# EAGLE design placa-circuito-impresso (EAGLE 9.6.0)
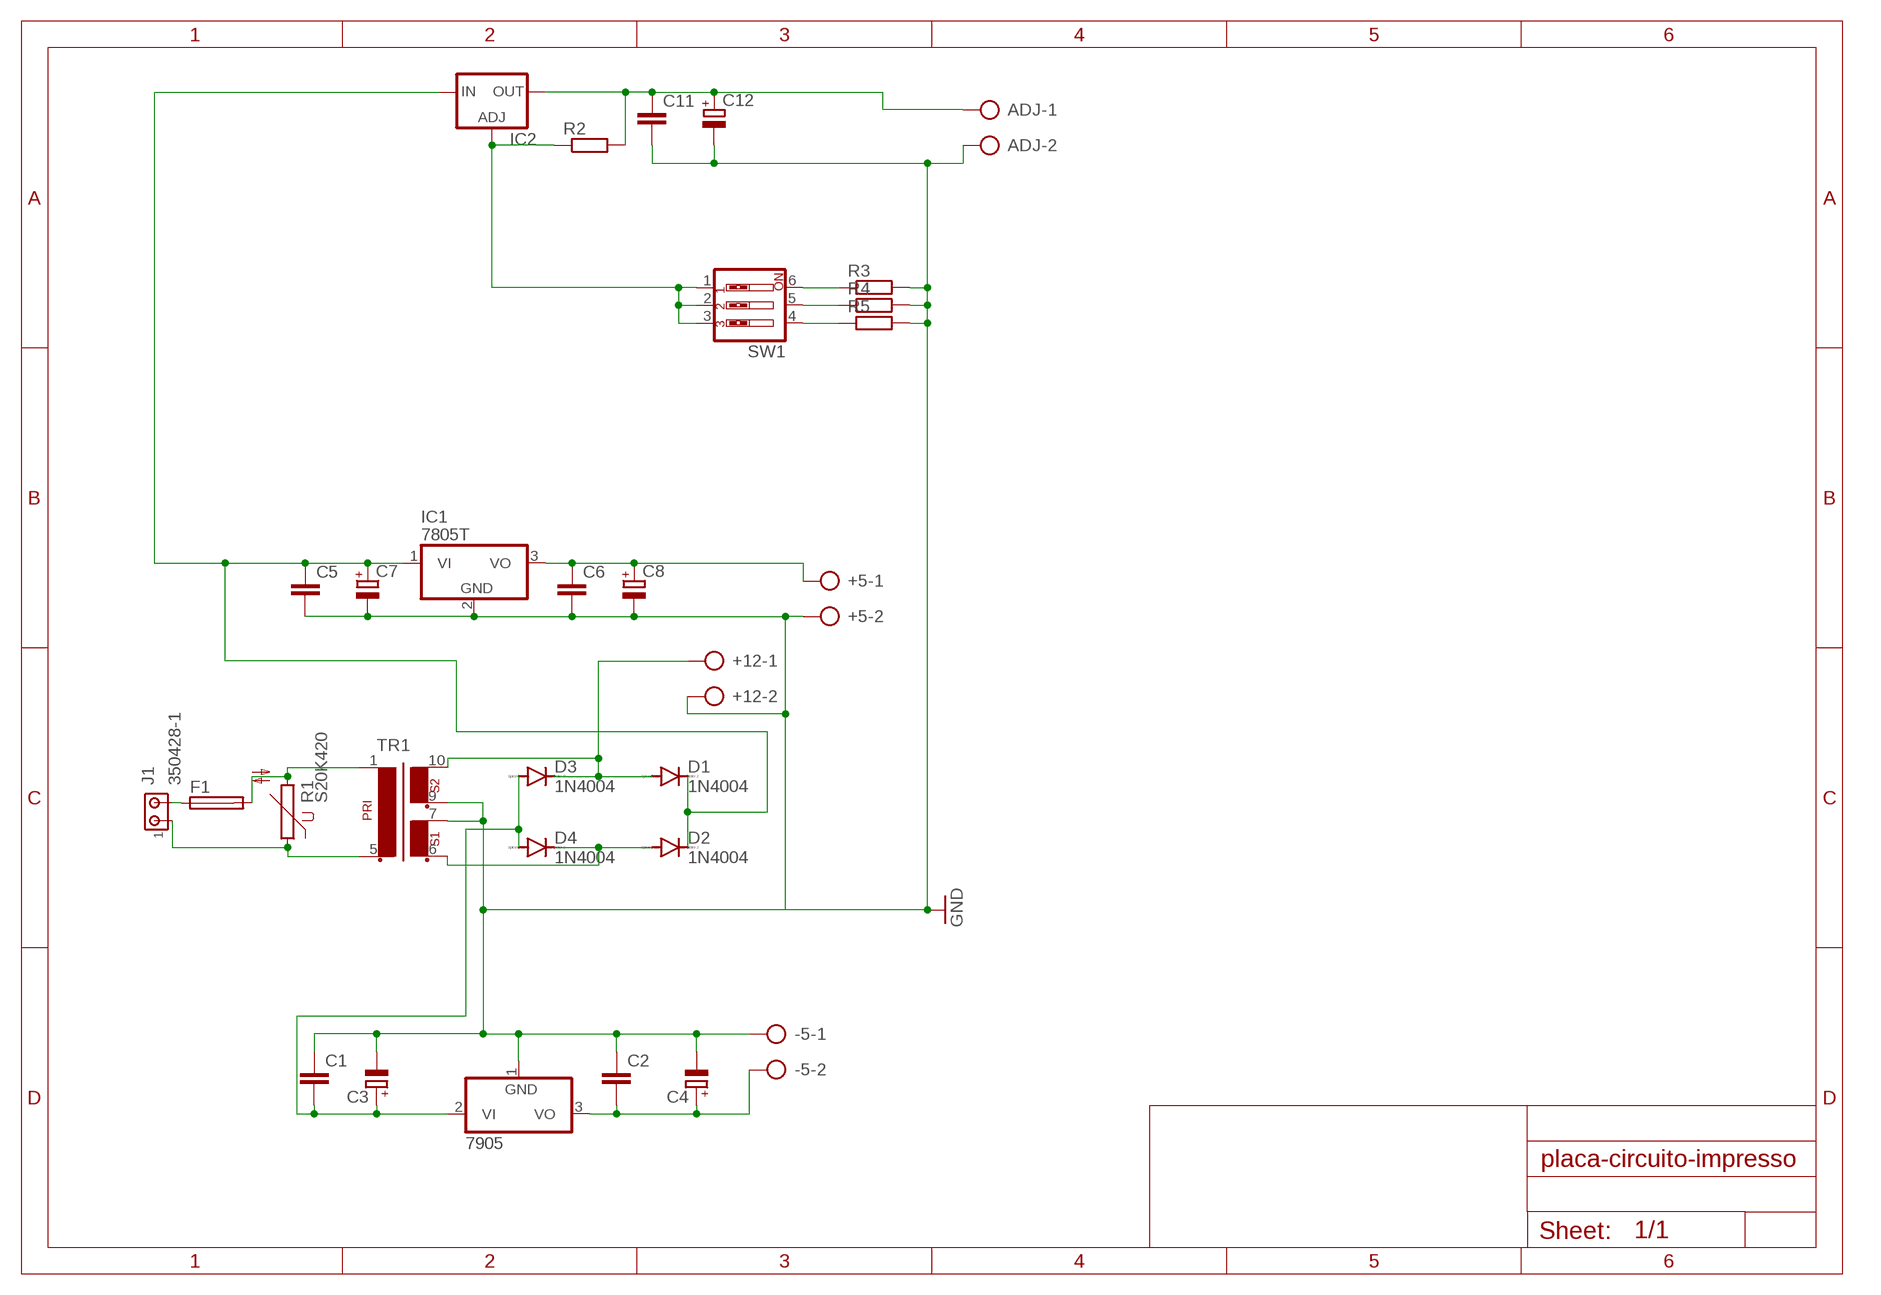
[diagram p0: schematic, sheet 1]

## Parts
7905  7905T  [TO220H]
+5  AK500/2-H  [AK500/2-H]
+12  AK500/2-H  [AK500/2-H]
-5  AK500/2-H  [AK500/2-H]
ADJ  AK500/2-H  [AK500/2-H]
C1  C-EU025-025X050  [C025-025X050]
C2  C-EU025-025X050  [C025-025X050]
C3  CPOL-EUE2,5-6E  [E2,5-6E]
C4  CPOL-EUE2,5-6E  [E2,5-6E]
C5  C-EU025-025X050  [C025-025X050]
C6  C-EU025-025X050  [C025-025X050]
C7  CPOL-EUE2,5-6E  [E2,5-6E]
C8  CPOL-EUE2,5-6E  [E2,5-6E]
C11  C-EU025-025X050  [C025-025X050]
C12  CPOL-EUE2,5-6E  [E2,5-6E]
D1  1N4004  [DO41-10]
D2  1N4004  [DO41-10]
D3  1N4004  [DO41-10]
D4  1N4004  [DO41-10]
F1  GSH15  [GSH15]
IC1  7805T  [TO220H]
IC2  LM317TL  [317TL]
J1  350428-1  [350428-1]
R1  S20K420  [S20K420]
R2  R-EU_0204/7  [0204/7]
R3  R-EU_0204/7  [0204/7]
R4  R-EU_0204/7  [0204/7]
R5  R-EU_0204/7  [0204/7]
SW1  SW_DIP-3  [EDG-03]
TR1  EI30-2  [EI30-2]

## Nets
GND [large]: 7905.1(GND) +5.2 +12.2 -5.1 ADJ.2 C1.1 C2.1 C3.- C4.- C5.2 C6.2 C7.- C8.- C11.2 C12.- IC1.2(GND) R3.2 R4.2 R5.2 TR1.7 TR1.9
N$1 [large]: F1.1 J1.2
N$2 [large]: J1.1 R1.1 TR1.5
N$3 [large]: F1.2 R1.2 TR1.1
N$4 [large]: +12.1 D1.A D3.C TR1.10
N$5 [large]: R3.1 SW1.6
N$6 [large]: 7905.2(VI) C1.2 C3.+ D3.A D4.A
N$7 [large]: R4.1 SW1.5
N$8 [large]: 7905.3(VO) -5.2 C2.2 C4.+
N$9 [large]: +5.1 C6.1 C8.+ IC1.3(VO)
N$10 [large]: C5.1 C7.+ D1.C D2.C IC1.1(VI) IC2.3(IN)
N$11 [large]: ADJ.1 C11.1 C12.+ IC2.2(OUT) R2.2
N$12 [large]: D2.A D4.C TR1.6
N$13 [large]: IC2.1(ADJ) R2.1 SW1.1 SW1.2 SW1.3
N$14 [large]: R5.1 SW1.4

## Library data of the parts
7905 = linear:79*: Negative VOLTAGE REGULATOR
+5 +12 -5 ADJ = con-ptr500:AK500/2-H: CONNECTOR Aug. 2004 / PTR Meßtechnik: Die Bezeichnung der Serie AK505 wurde geändert. Es handelt sich hierbei um AK500 in horizontaler Ausführung.; OC_FARNELL: unknown; OC_NEWARK: unknown
C1 C2 C5 C6 C11 = rcl:C-EU: CAPACITOR, European symbol; SPICEPREFIX: C
C3 C4 C7 C8 C12 = rcl:CPOL-EU: POLARIZED CAPACITOR, European symbol; SPICEPREFIX: C
D1-D4 = diode:1N4004: DIODE general purpose rectifier, 1 A
F1 = fuse:GSH15: FUSE HOLDER grid 15mm, 19649 Wickmann; MPN: 64900001039; OC_FARNELL: 1271673; OC_NEWARK: 02P0318
IC1 = linear:78*: Positive VOLTAGE REGULATOR Source: http://cache.national.com/ds/LM/LM78L05.pdf http://www.fairchildsemi.com/ds/LM/LM7805.pdf
IC2 = v-reg:LM317TL: VOLTAGE REGULATOR
J1 = con-amp:350428-1: Universal MATE-N-LOK .250" Centerline, 600 V, 19 - 36 A max Source: http://catalog.tycoelectronics.com/ .. ENG_CD_350428_Y.pdf
R1 = varistor:S20K420: VARISTOR
R2-R5 = rcl:R-EU_: RESISTOR, European symbol; SPICEPREFIX: R
SW1 = special:SW_DIP-3: DIP SWITCH
TR1 = trafo:EI30-2: TRANSFORMER 1 primary winding, 2 secondary windings ERA

## Net classes
0 default: width 0.813 mm
1 large: width 0.813 mm

## Board
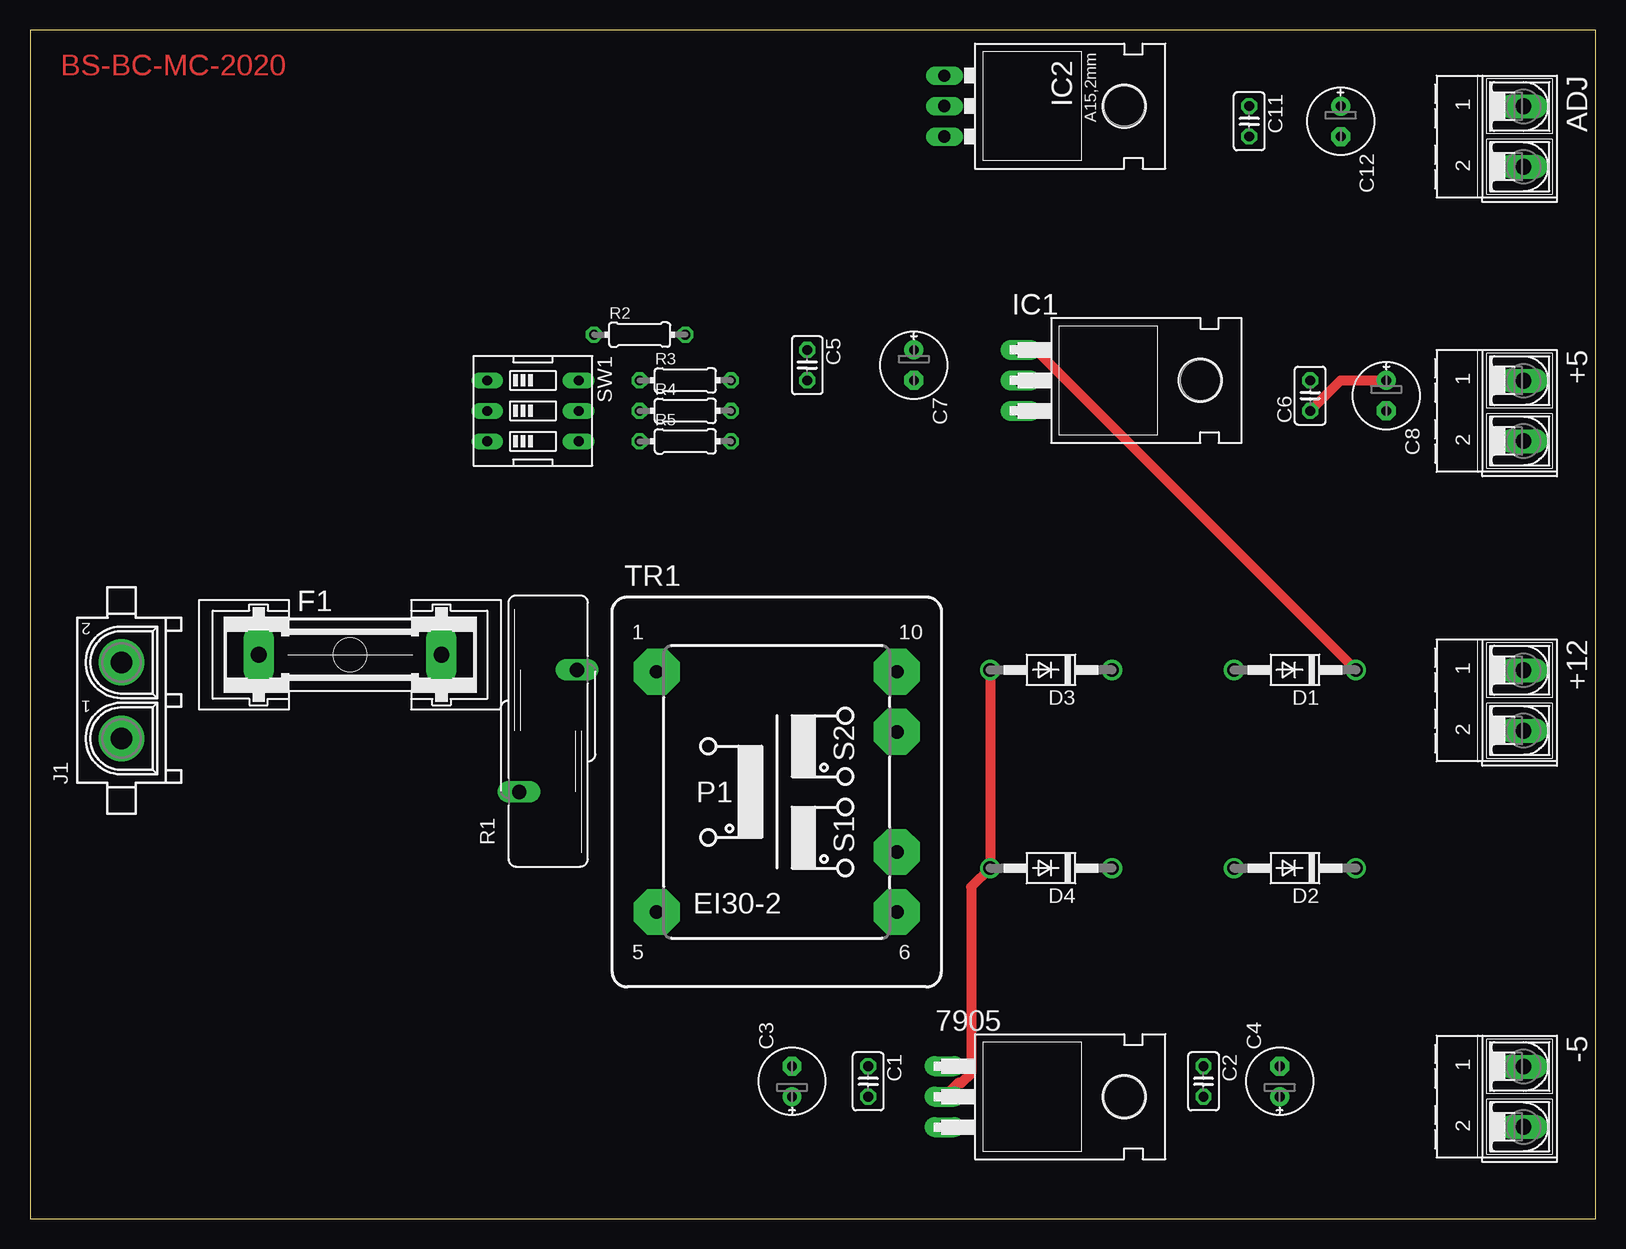
[diagram p1: board, top side]
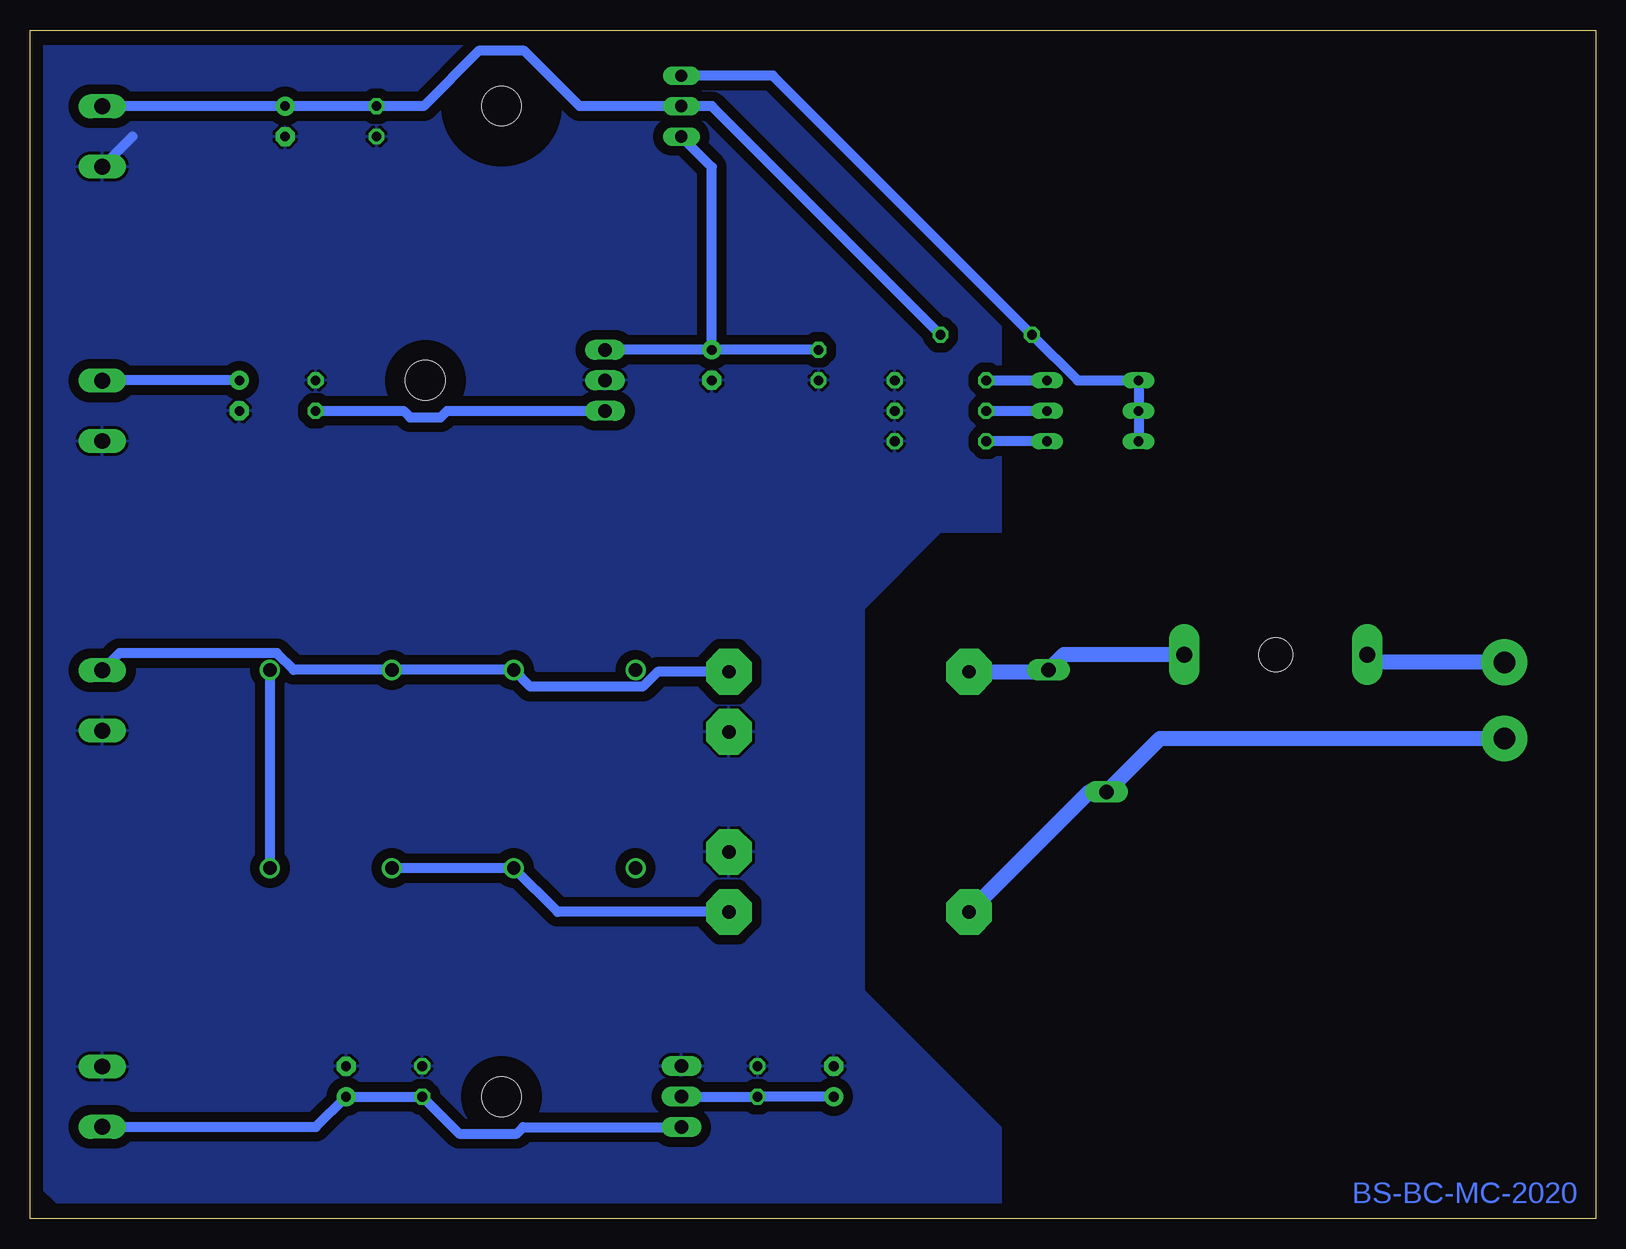
[diagram p2: board, bottom side, seen from below]

Size 130.48 x 99.05 mm. Coordinates in mm from the lower left corner, seen from the top.
Outline: 0,0 130.48,0 130.48,99.05 0,99.05 0,0
Copper layers (1*16): Top 0.035mm / dielectric 1.5mm / Bottom 0.035mm
Design rules "default": minimum track width 6mil, minimum drill 0.35mm, track to track 6mil, track to pad 6mil, pad to pad 6mil, via to via 6mil, smd to smd 6mil, copper to edge 40mil, drill to drill 6mil, minimum pad ring 10mil, minimum via ring 8mil, stop-mask expansion 4mil, vias tented up to drill 0mil, thermal gap 10mil

### Footprints (pad centres in the part's own frame; a part is rotated, then mirrored left to right if it is on the bottom)
TO220H = drill 1.118 long: 1 -2.54,-10.16; 2 0,-10.16; 3 2.54,-10.16 | hole 3.302: 0,4.826
AK500/2-H = drill 1.321 long: 1 -2.515,0; 2 2.515,0
C025-025X050 = drill 0.813 octagon: 1 -1.27,0; 2 1.27,0
E2,5-6E = drill 0.813 pad 1.575: + -1.27,0 | drill 0.813 pad 1.575 octagon: - 1.27,0
DO41-10 = drill 1.118: A 5.08,0; C -5.08,0
GSH15 = drill 1.321 pad 2.54 long: 1 -7.62,0; 2 7.62,0 | hole 2.794: 0,0
317TL = drill 1.016 long: 1 -2.54,-3.81; 2 0,-3.81; 3 2.54,-3.81 | hole 3.302: 0,11.176
350428-1 = drill 1.8 pad 3.81: 1 -3.175,0; 2 3.175,0
S20K420 = drill 1.194 long: 1 -2.413,-5.08; 2 2.413,5.08
0204/7 = drill 0.813 octagon: 1 -3.81,0; 2 3.81,0
EDG-03 = drill 0.813 long: 1 -2.54,-3.81; 2 0,-3.81; 3 2.54,-3.81; 4 2.54,3.81; 5 0,3.81; 6 -2.54,3.81
EI30-2 = drill 1.118 pad 3.81 octagon: 1 -10.008,10.008; 5 -10.008,-10.008; 6 10.008,-10.008; 7 10.008,-5.004; 9 10.008,5.004; 10 10.008,10.008

### Placement (x,y rotation side)
7905  86.36,10.16 270 top
+5  124.46,67.31 270 top
+12  124.46,43.18 270 top
-5  124.46,10.16 270 top
ADJ  124.46,90.17 270 top
C1  69.85,11.43 270 top
C2  97.79,11.43 270 top
C3  63.5,11.43 90 top
C4  104.14,11.43 90 top
C5  64.77,71.12 270 top
C6  106.68,68.58 90 top
C7  73.66,71.12 270 top
C8  113.03,68.58 270 top
C11  101.6,91.44 270 top
C12  109.22,91.44 270 top
D1  105.41,45.72 180 top
D2  105.41,29.21 180 top
D3  85.09,45.72 180 top
D4  85.09,29.21 180 top
F1  26.67,46.99 0 top
IC1  92.71,69.85 270 top
IC2  80.01,92.71 270 top
J1  7.62,43.18 90 top
R1  43.18,40.64 0 top
R2  50.8,73.66 0 top
R3  54.61,69.85 0 top
R4  54.61,67.31 0 top
R5  54.61,64.77 0 top
SW1  41.91,67.31 270 top
TR1  62.23,35.56 0 top

### Tracks (layer width: path | path; a pad name or v marks a point on that pad's centre or on a via)
GND
  Bottom 0.813: 121.95,90.17 ADJ.2
  pour Bottom (isolate 0.813): 49.53,97.79 49.53,57.15 54.61,57.15 60.96,50.8 60.96,19.05 49.53,7.62 49.53,1.27 128.27,1.27 129.54,2.54 129.54,97.79
N$1
  Bottom 0.813: 18.41,46.36 F1.1
  Bottom 1.27: J1.2 18.41,46.36
N$2
  Bottom 1.27: J1.1 36.32,40.01 R1.1 42.22,35.56 TR1.5
N$3
  Bottom 1.27: F1.2 44.32,46.99 R1.2 45.75,45.57 TR1.1
N$4
  Bottom 0.813: TR1.10 78.19,45.57 79.43,44.32 88.77,44.32 D3.C D1.A 108.51,45.72 109.91,47.12 123.04,47.12 +12.1
N$5
  Bottom 0.813: R3.1 SW1.6
N$6
  Top 0.813: D3.A D4.A 78.44,27.64 78.44,12.12 77.62,11.3 77.34,11.3 7905.2
  Bottom 0.813: C3.+ C1.2 7905.2
N$7
  Bottom 0.813: R4.1 SW1.5
N$8
  Bottom 0.813: 7905.3 89.38,7.62 89.91,7.09 94.72,7.09 C2.2 C4.+ 106.66,7.65 -5.2
N$9
  Top 0.813: C6.1 109.22,69.85 C8.+
  Bottom 0.813: C6.1 99.34,67.31 98.81,66.78 96.26,66.78 95.73,67.31 IC1.3 | C8.+ 124.44,69.85 +5.1
N$10
  Top 0.813: D1.C 83.82,72.39 IC1.1
  Bottom 0.813: D1.C D2.C | C5.1 C7.+ | C7.+ IC1.1 | C7.+ 73.66,87.63 IC2.3
N$11
  Bottom 0.813: R2.2 73.66,92.71 IC2.2 84.68,92.71 89.28,97.31 93.09,97.31 97.69,92.71 C11.1 C12.+ 124.44,92.71 ADJ.1
N$12
  Bottom 0.813: TR1.6 86.51,25.55 D4.C D2.A
N$13
  Bottom 0.813: SW1.3 SW1.2 SW1.1 43.18,69.85 R2.1 68.58,95.25 IC2.1
N$14
  Bottom 0.813: SW1.4 R5.1

### Text on the board
Top: BS-BC-MC-2020
Bottom: BS-BC-MC-2020